# EasyEDA Pro project ProPrj_LXBRC-STM32F405飞控_2024-08-19.epro, schematic LXBRC-F405_V1.1

## Sheets
1 F405_V1.1: Create Date: 2023-12-14; Page Name: F405_V1.1; Project Name: LXBRC-STM32F405飞控; Schematic Name: LXBRC-F405_V1.1; Update Date: 2023-12-14; Company: 嘉立创EDA; Page Size: A0; Version: V1.0
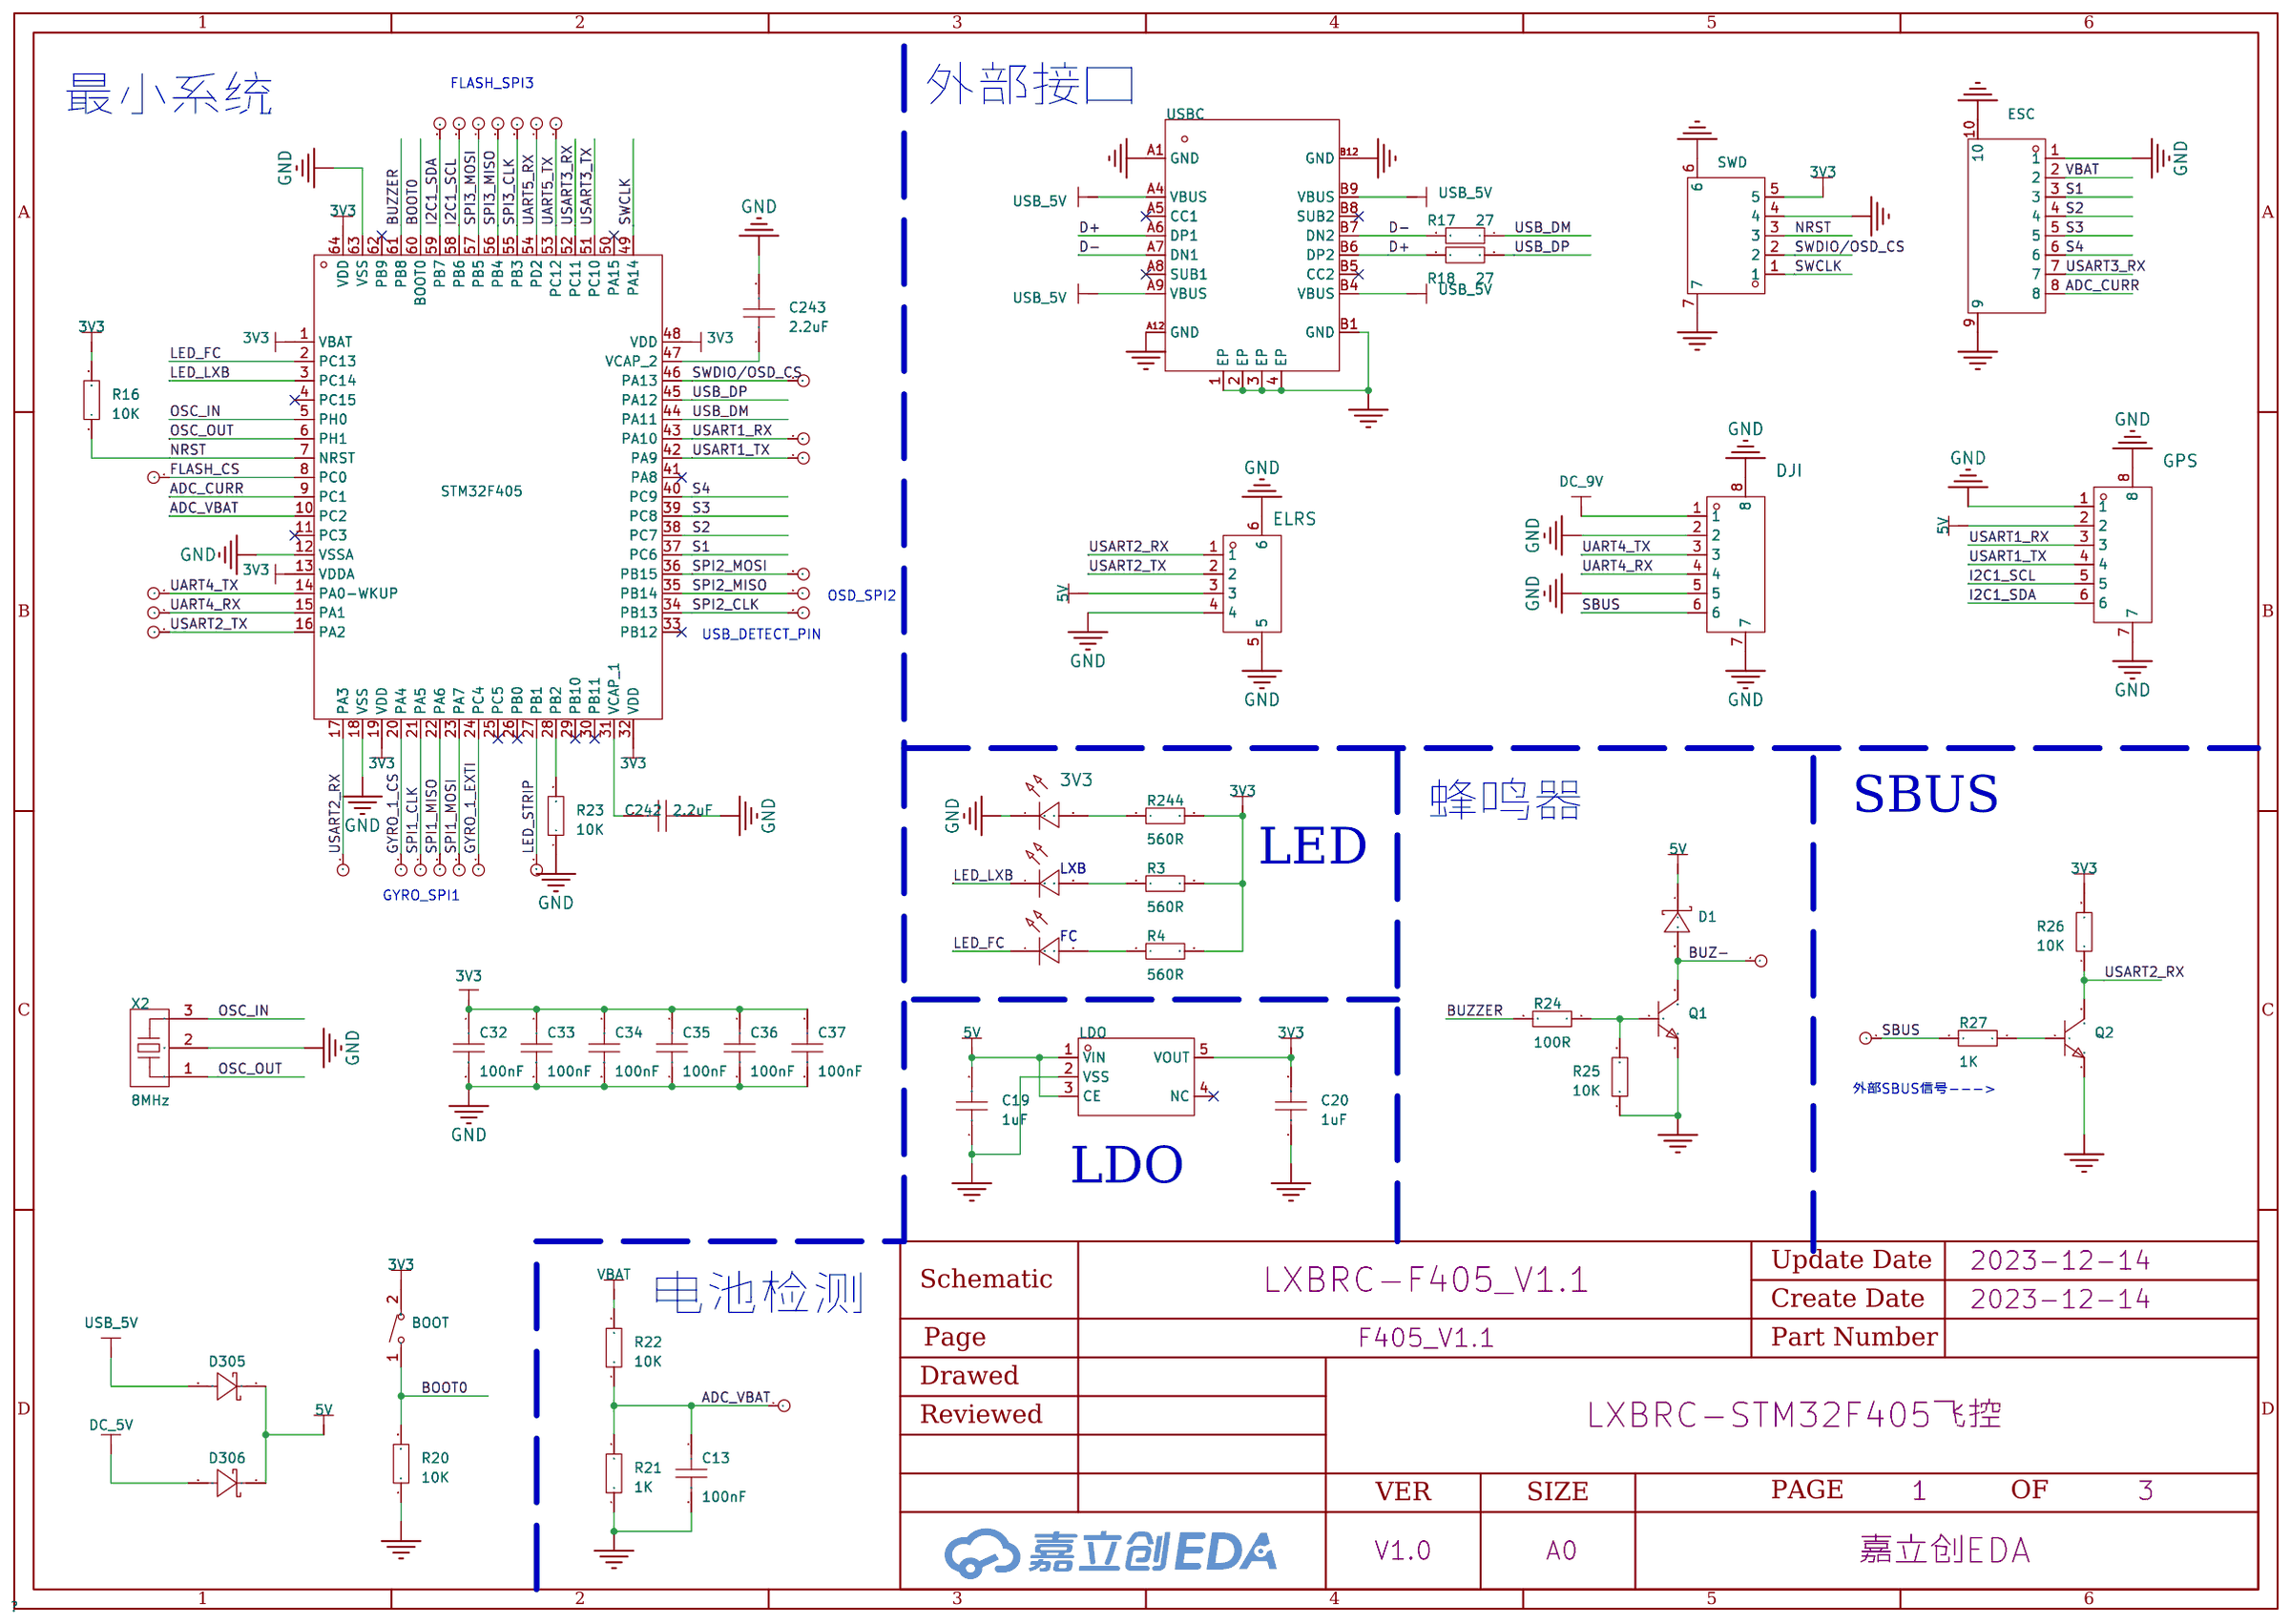
[diagram p0: F405_V1.1]
2 Power_V1.1: Create Date: 2023-06-24; Page Name: Power_V1.1; Project Name: LXBSZ-F405; Schematic Name: LXBSZ-F405_V1.0; Update Date: 2023-11-19; Page Size: A4
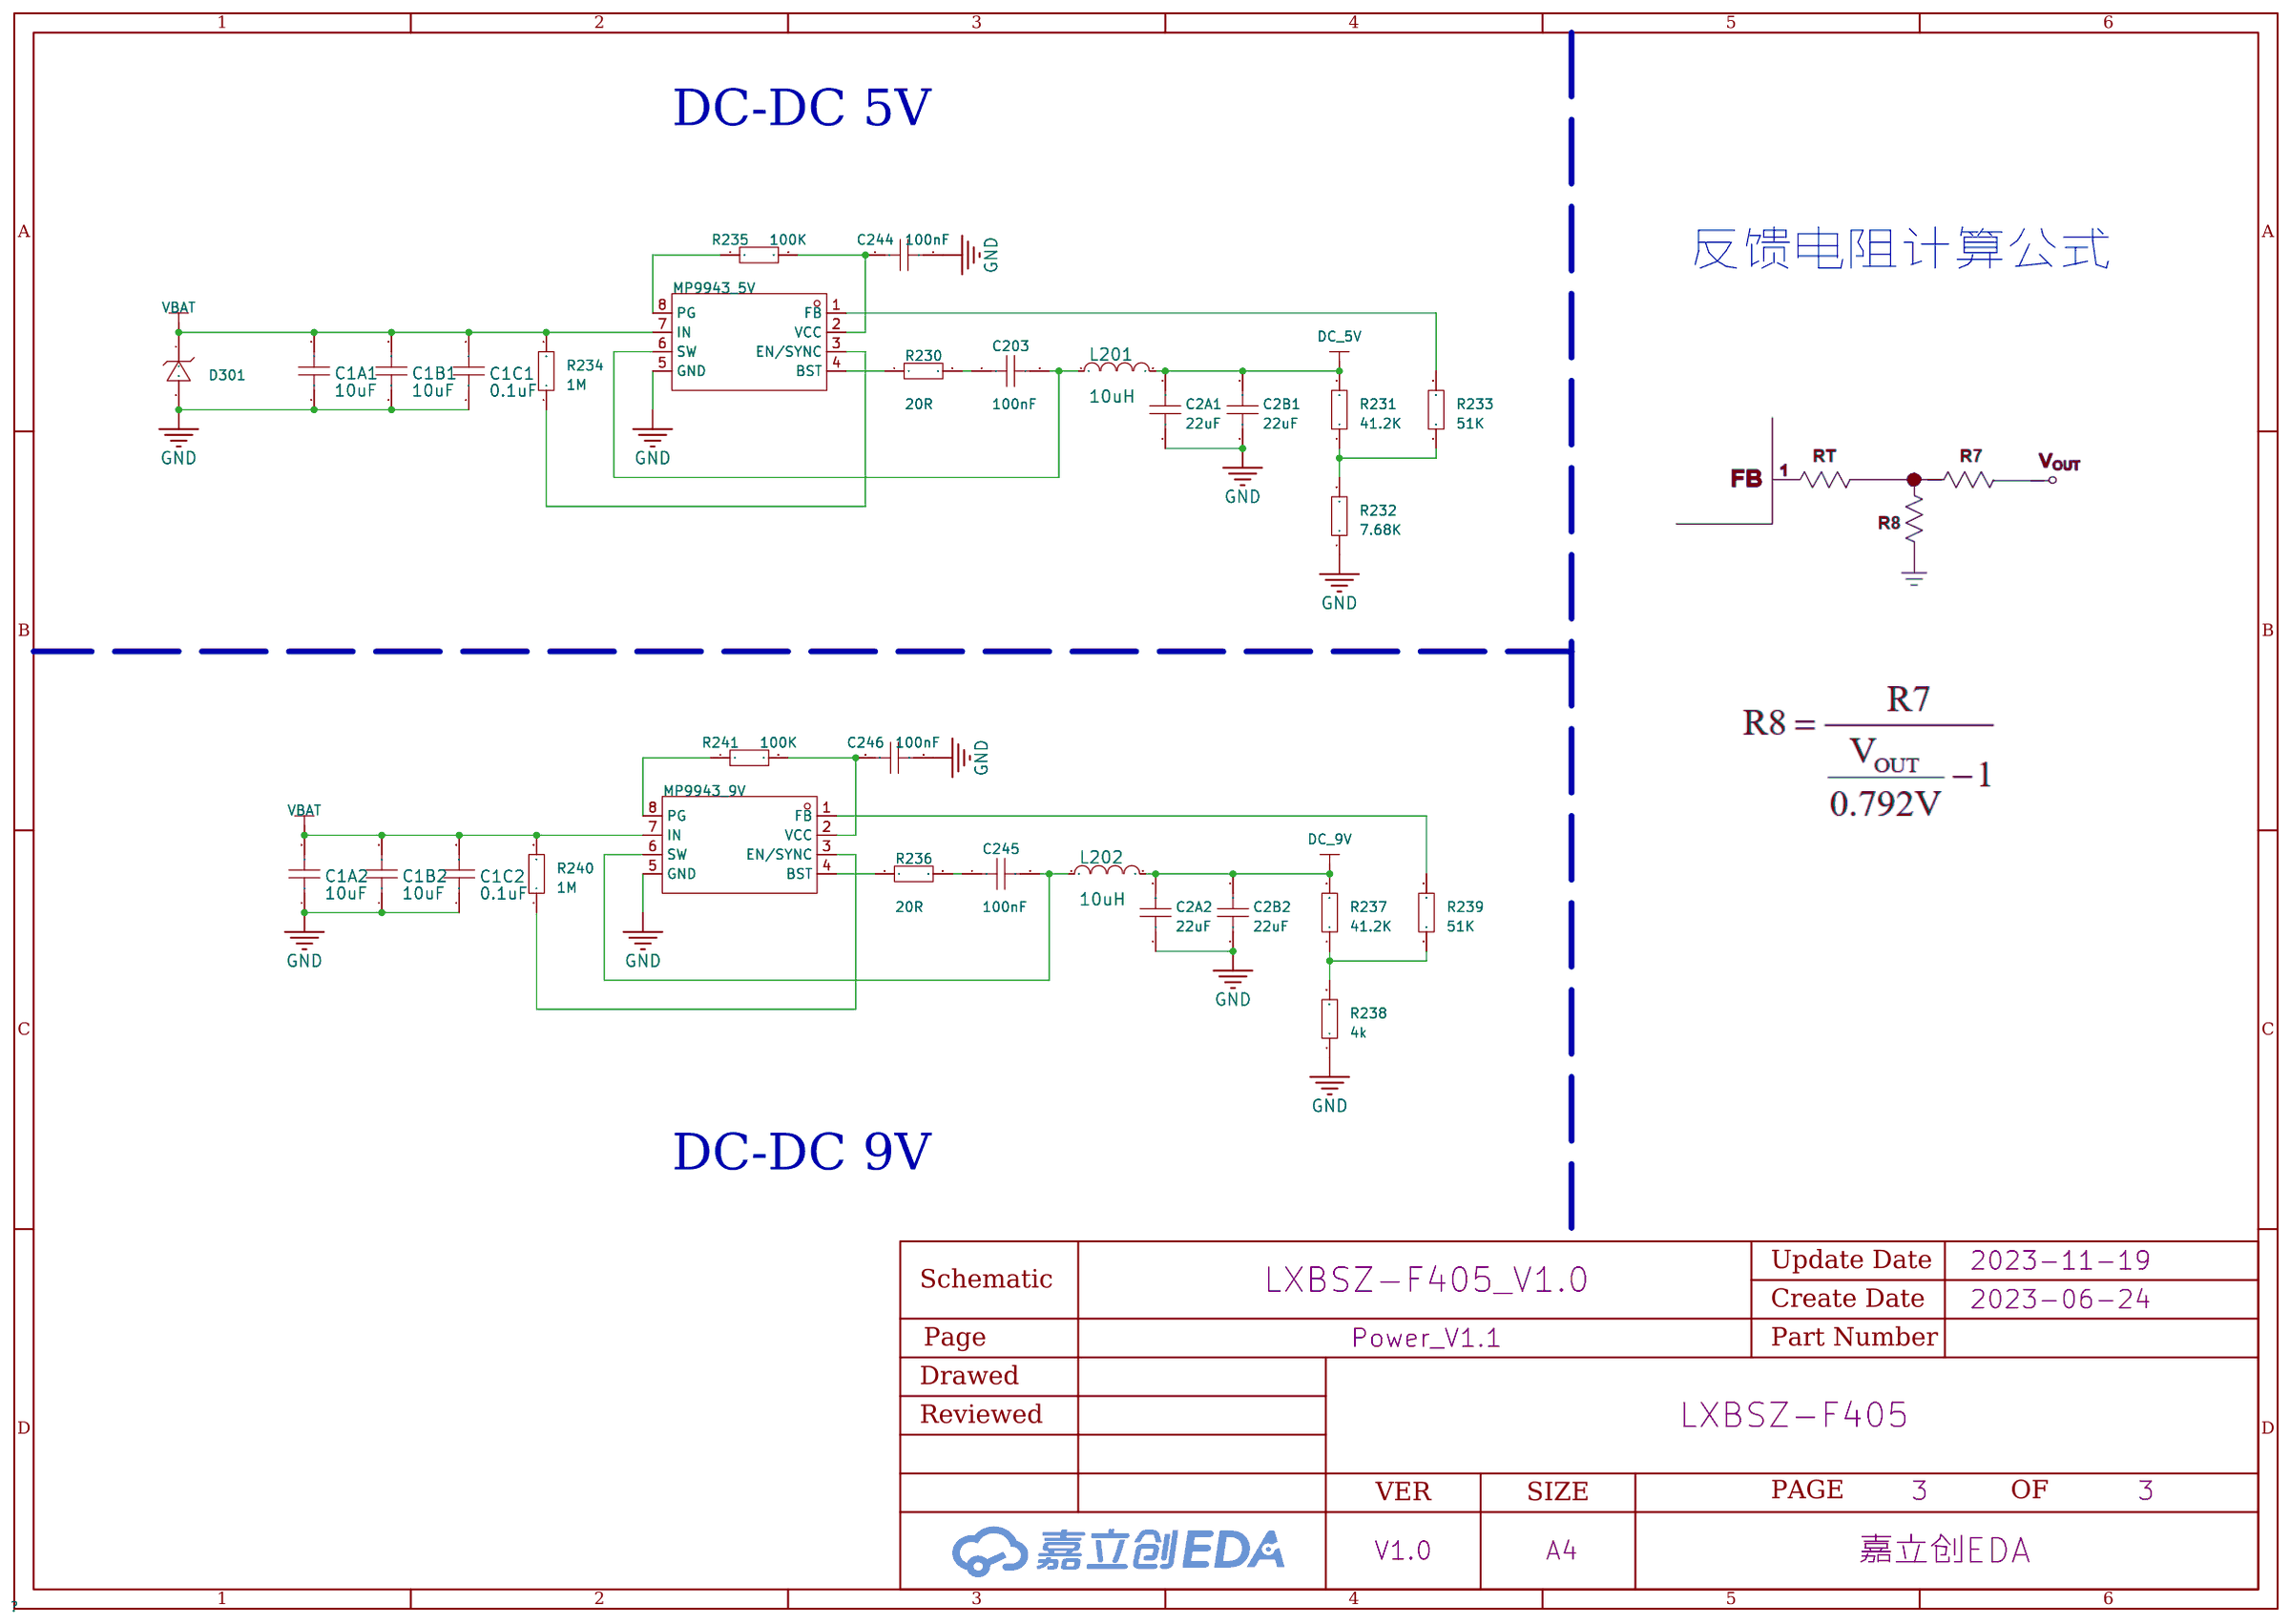
[diagram p1: Power_V1.1]
3 Peripheral_V1.1: Create Date: 2023-06-24; Page Name: Peripheral_V1.1; Project Name: LXBSZ-F405; Schematic Name: LXBSZ-F405_V1.0; Update Date: 2023-11-19; Page Size: A4
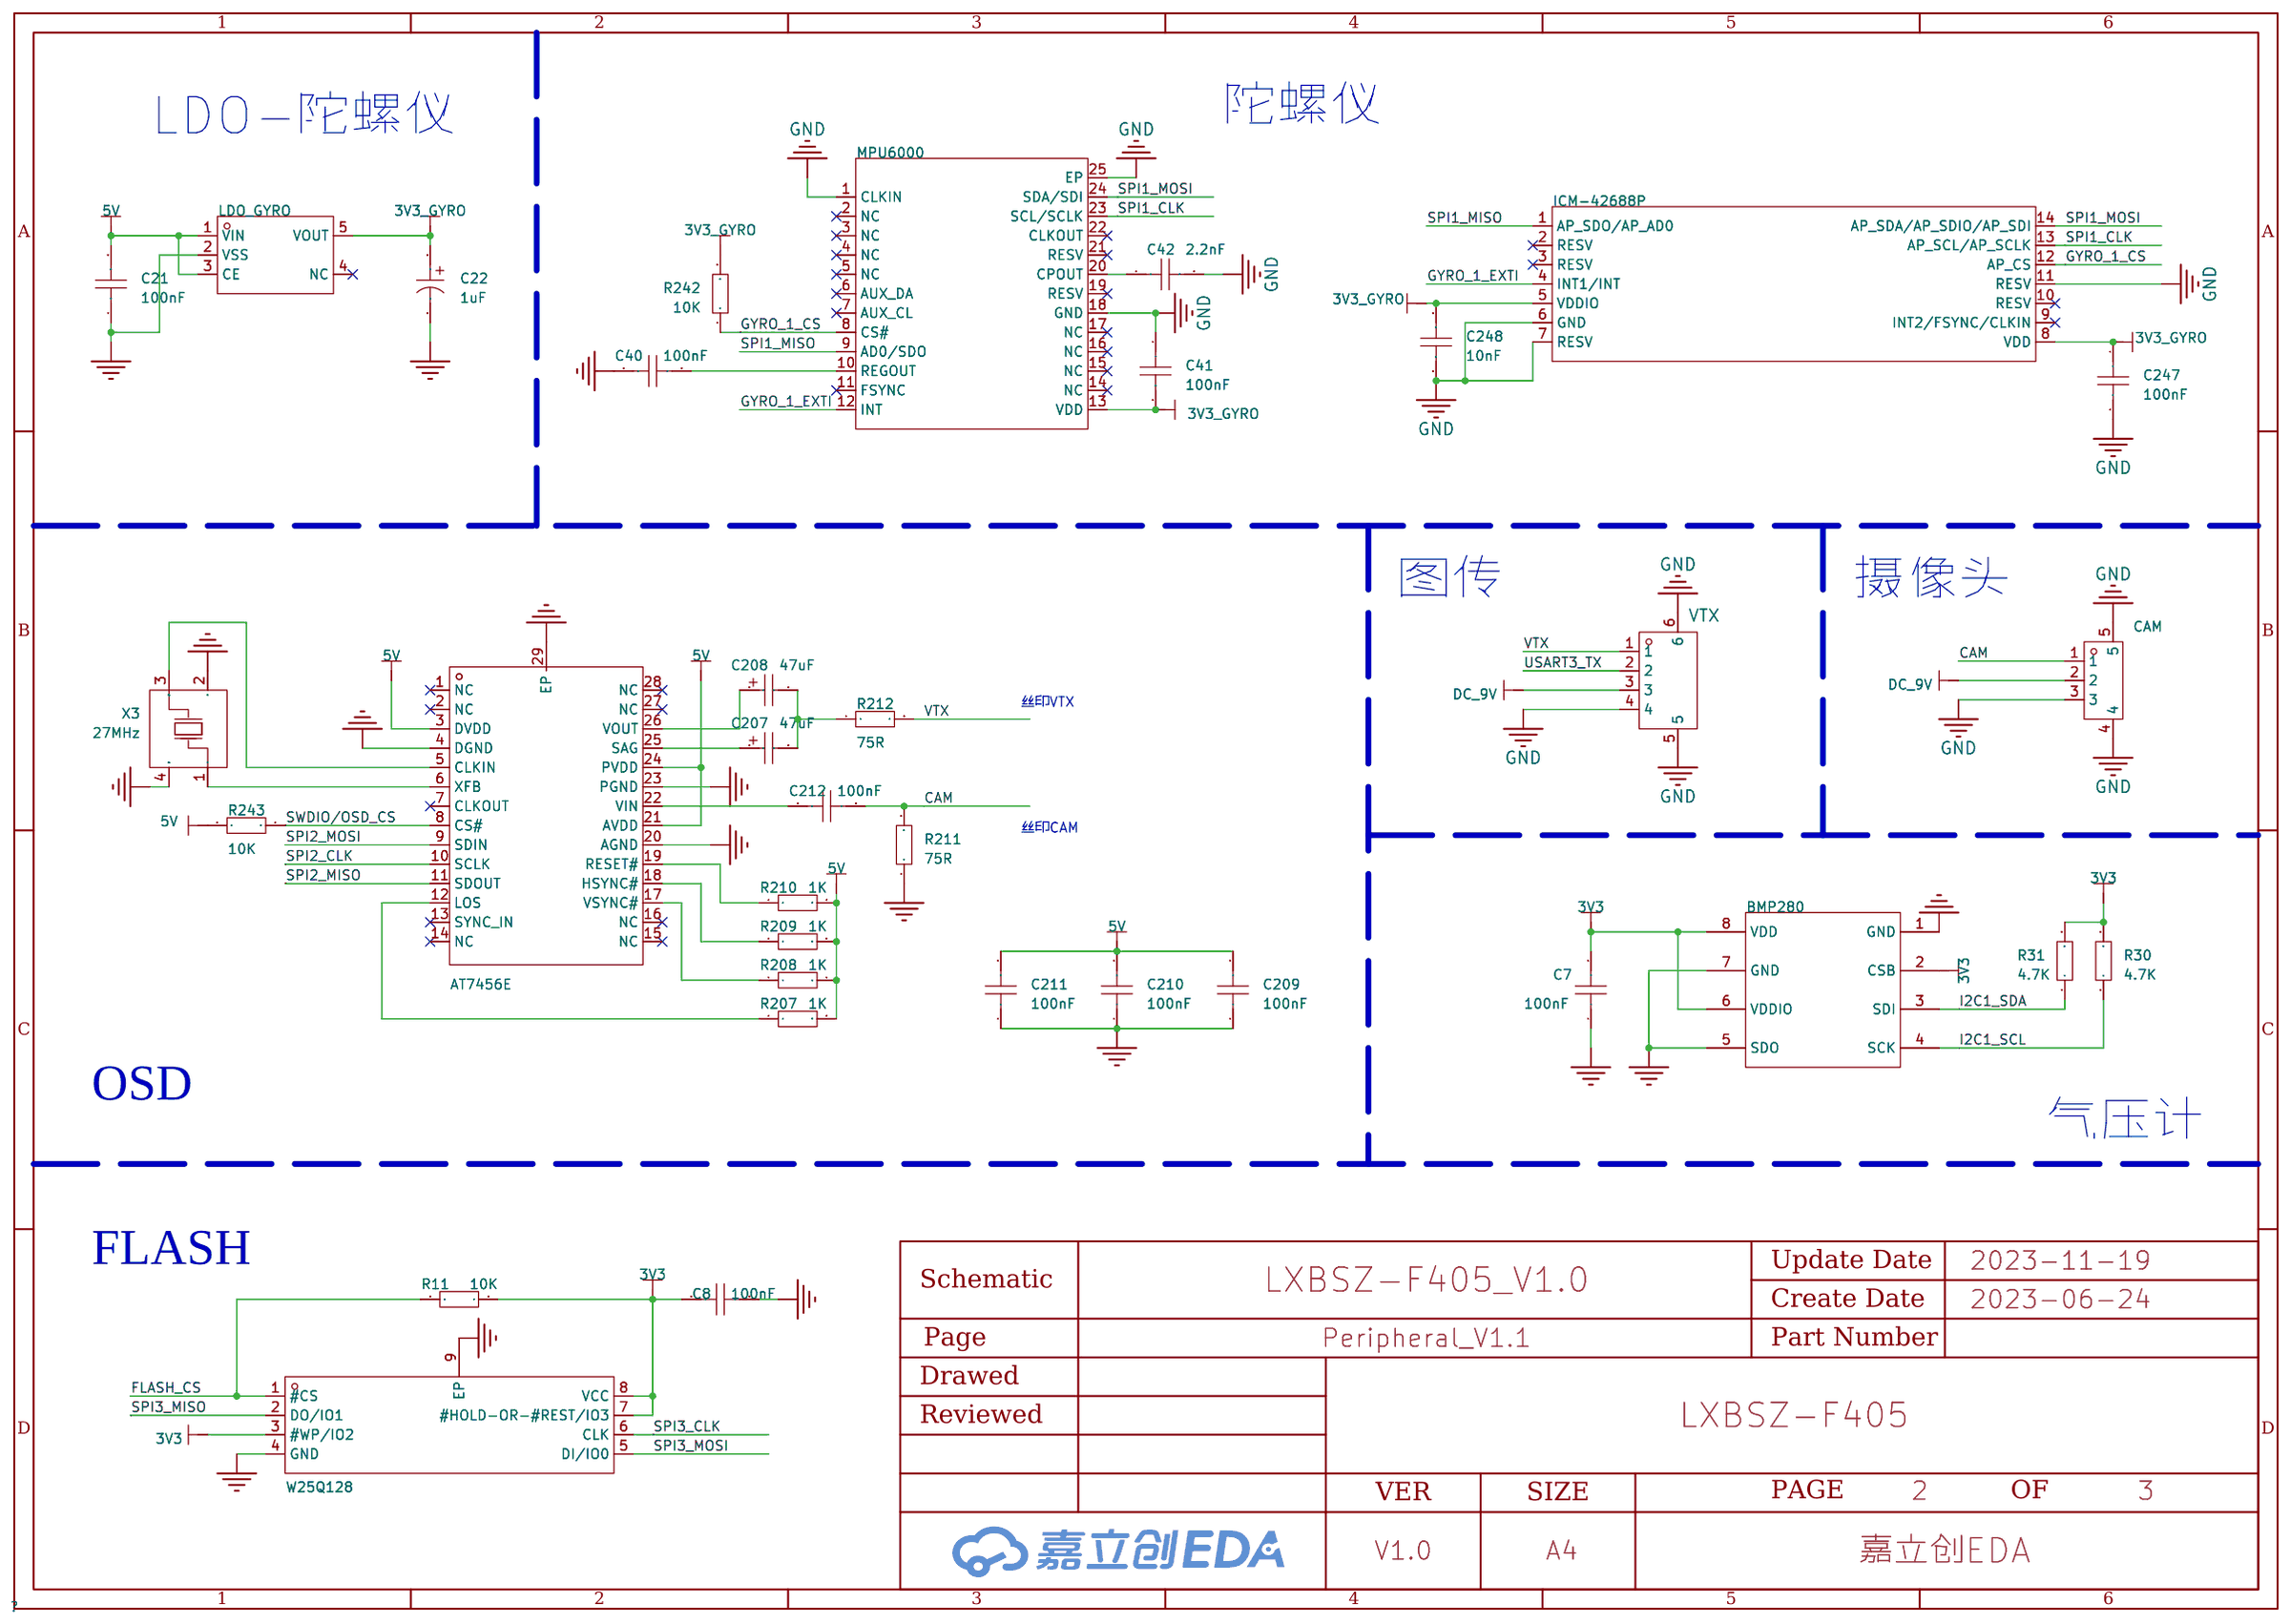
[diagram p2: Peripheral_V1.1]

## Parts
sheet F405_V1.1
3V3  -  [LED_0402]
BOOT  TS2306A 200gf 002  [SW-SMD_L3.0-W2.0-LS3.5]
C13  100nF  [C0402]
C19  1uF  [C0603]
C20  1uF  [C0603]
C32  100nF  [C0402]
C33  100nF  [C0402]
C34  100nF  [C0402]
C35  100nF  [C0402]
C36  100nF  [C0402]
C37  100nF  [C0402]
C242  2.2uF  [C0402]
C243  2.2uF  [C0402]
D1  B5819WS  [SOD-323_L1.8-W1.3-LS2.5-RD]
D305  B5819W  [SOD-123F_L2.7-W1.6-LS3.8-RD-1]
D306  B5819W  [SOD-123F_L2.7-W1.6-LS3.8-RD-1]
DJI  ZX-SH1.0-6PWT  [CONN-SMD_6P-P1.00_MEGASTAR_ZX-SH1.0-6PWT]
ELRS  ZX-SH1.0-4PWT  [CONN-SMD_4P-P1.00_MEGASTAR_ZX-SH1.0-4PWT]
ESC  A1002WR-S-8P  [CONN-SMD_8P-P1.00_MEGASTAR_ZX-SH1.0-8PWT]
FC  -  [LED_0402]
G2  -  [通孔焊盘]
G3  -  [通孔焊盘]
G4  -  [通孔焊盘]
G7  -  [通孔焊盘]
G8  -  [通孔焊盘]
G9  -  [通孔焊盘]
G10  -  [通孔焊盘]
G11  -  [通孔焊盘]
G12  -  [通孔焊盘]
G13  -  [通孔焊盘]
G14  -  [通孔焊盘]
G15  -  [通孔焊盘]
G16  -  [通孔焊盘]
G17  -  [通孔焊盘]
G18  -  [通孔焊盘]
G19  -  [通孔焊盘]
G20  -  [通孔焊盘]
G21  -  [通孔焊盘]
G22  -  [通孔焊盘]
G23  -  [通孔焊盘]
G24  -  [通孔焊盘]
G25  -  [通孔焊盘]
G26  -  [通孔焊盘]
G27  -  [通孔焊盘]
G28  -  [通孔焊盘]
GPS  ZX-SH1.0-6PWT  [CONN-SMD_6P-P1.00_MEGASTAR_ZX-SH1.0-6PWT]
HP15  -  [通孔焊盘]
LDO  CJ6206B33M  [SOT-23-5_L2.9-W1.6-P0.95-LS2.8-BL]
LXB  -  [LED_0402]
Q1  -  [S8050_SOT-23]
Q2  -  [S8050_SOT-23]
R3  560R  [R0402]
R4  560R  [R0402]
R16  10K  [R0402]
R17  27  [R0402]
R18  27  [R0402]
R20  10K  [R0402]
R21  1K  [R0402]
R22  10K  [R0402]
R23  10K  [R0402]
R24  100R  [R0402]
R25  10K  [R0402]
R26  10K  [R0402]
R27  1K  [R0402]
R244  560R  [R0402]
RC1  -  [通孔焊盘]
STM32F405  STM32F405RGT6V  [LQFP-64_L10.0-W10.0-P0.50-LS12.0-BL]
SWD  A1002WR-S-5P  [CONN-SMD_5P-P1.00_MEGASTAR_ZX-SH1.0-5PWT]
USBC  KH-TYPE-C-16P  [USB-C-SMD_KH-TYPE-C-16P]
X2  8MHz  [OSC-SMD_3P-L3.2-W1.3-P1.2-L]
sheet Peripheral_V1.1
AT7456E  AT7456E  [TSSOP-28_L9.7-W4.4-P0.65-LS6.4-BL-EP-2]
BMP280  BMP280  [WLGA-8_L2.5-W2.0-P0.65-TR_DPS422]
C7  100nF  [C0402]
C8  100nF  [C0402]
C21  100nF  [C0603]
C22  1uF  [CAP-SMD_L1.6-W0.8-RD]
C40  100nF  [C0402]
C41  100nF  [C0402]
C42  2.2nF  [C0402]
C207  47uF  [CASE-A_3216]
C208  47uF  [CASE-A_3216]
C209  100nF  [C0402]
C210  100nF  [C0402]
C211  100nF  [C0402]
C212  100nF  [C0402]
C247  100nF  [C0402]
C248  10nF  [C0402]
CAM  WTB01W03BB  [CONN-SMD_3P-P1.00_BZCN_WTB01W03BB]
ICM-42688P  ICM-42688-P  [LGA-14_L3.0-W2.5-P0.50-TL]
LDO_GYRO  CJ6206B33M  [SOT-23-5_L2.9-W1.6-P0.95-LS2.8-BL]
MPU6000  MPU-6000  [QFN-24_L4.0-W4.0-P0.50-BL-EP2.7]
R11  10K  [R0402]
R30  4.7K  [R0402]
R31  4.7K  [R0402]
R207  1K  [R0402]
R208  1K  [R0402]
R209  1K  [R0402]
R210  1K  [R0402]
R211  75R  [R0402]
R212  75R  [R0402]
R242  10K  [R0402]
R243  10K  [R0402]
VTX  ZX-SH1.0-4PWT  [CONN-SMD_4P-P1.00_MEGASTAR_ZX-SH1.0-4PWT]
W25Q128  W25Q128JVPIQ  [WSON-8_L6.0-W5.0-P1.27-BL-EP]
X3  27MHz  [OSC-SMD_4P-L3.2-W2.5-BL]
sheet Power_V1.1
C1A1  10uF  [C0805]
C1A2  10uF  [C0805]
C1B1  10uF  [C0805]
C1B2  10uF  [C0805]
C1C1  0.1uF  [C0603]
C1C2  0.1uF  [C0603]
C2A1  22uF  [C0805]
C2A2  22uF  [C0805]
C2B1  22uF  [C0805]
C2B2  22uF  [C0805]
C203  100nF  [C0402]
C244  100nF  [C0402]
C245  100nF  [C0402]
C246  100nF  [C0402]
D301  SMF33A  [SOD-123FL_L2.7-W1.8-LS3.8-RD]
L201  10uH  [IND-SMD_L4.4-W4.2]
L202  10uH  [IND-SMD_L4.4-W4.2]
MP9943_5V  MP9943GQ-Z  [QFN-8_L3.0-W3.0-P0.65-BL]
MP9943_9V  MP9943GQ-Z  [QFN-8_L3.0-W3.0-P0.65-BL]
R230  20R  [R0402]
R231  41.2K  [R0402]
R232  7.68K  [R0402]
R233  51K  [R0402]
R234  1M  [R0402]
R235  100K  [R0402]
R236  20R  [R0402]
R237  41.2K  [R0402]
R238  4k  [R0402]
R239  51K  [R0402]
R240  1M  [R0402]
R241  100K  [R0402]

## Library data of the parts
3V3 = LED_0402-R: Supplier Footprint: 0402
BOOT = TS2306A 200gf 002: 触点电流：10mA 额定电压(DC)：5V 电路结构：单刀单掷 安装方式：立贴 按钮形状：圆形按钮 开关长度：3mm 开关宽度：2mm 开关高度：0.6mm 2x3x0.6 3x2激光内点轻触开关蓝牙耳机两脚贴片锅仔开关; LCSC Part Name: 薄膜开关 2*3*0.6mm 蓝牙耳机/开机按键 两脚 黄膜黑点 200gf; Supplier Part: C5363482; Manufacturer: SHOU HAN(首韩); Supplier Footprint: SMD; JLCPCB Part Class: 扩展库; Datasheet: https://atta.szlcsc.com/upload/public/pdf/source/20230321/144662D432400ADC228EB2A996730BBD.pdf; Supplier: LCSC
C7 C8 C13 C32-C37 C40-C42 C203 C209-C212 C242-C248 = CAP_0402: Supplier Footprint: 0402
C19-C21 = CAP_0603: Supplier Footprint: 0603
D1 = B5819WS_C488405: 直流反向耐压(Vr):40V;平均整流电流(Io):1A;正向压降(Vf):900mV@3A;; LCSC Part Name: 40V 1A 900mV@3A; Supplier Part: C488405; Manufacturer: Slkor(萨科微); Supplier Footprint: SOD-323; JLCPCB Part Class: Extended Part; Datasheet: https://atta.szlcsc.com/upload/public/pdf/source/20200225/C488405_E29BA61770FF7744B37A87F1ECFA4444.pdf; Supplier: LCSC; Reverse Voltage (Vr): 40V; Average Rectified Current (Io): 1A; Forward Voltage (Vf@If): 900mV@3A
D305 D306 = B5819W: 二极管配置:-;直流反向耐压(Vr):40V;平均整流电流(Io):1A;正向压降(Vf):580mV@1A;; LCSC Part Name: 40V 1A 580mV@1A; Supplier Part: C2943878; Manufacturer: GOODWORK(固得沃克); Supplier Footprint: SOD-123; JLCPCB Part Class: 扩展库; Datasheet: https://atta.szlcsc.com/upload/public/pdf/source/20220114/81042131F39C8520B6390246D7392C1A.pdf; Supplier: LCSC; Reverse Voltage (Vr): 40V; Average Rectified Current (Io): 1A; Forward Voltage (Vf@If): 580mV@1A; Reverse Leakage Current (Ir): 50uA@40V
DJI GPS = ZX-SH1.0-6PWT: 参考系列:SH;间距:1mm;插针结构:1x6P;排数:1;每排PIN数:6;行距:-;公母:公型插针;安装方式:卧贴;额定电流:1A;触头材质:黄铜;触头镀层:锡;工作温度范围:-25℃~+85℃;焊接温度(最大值):260℃;; LCSC Part Name: 系列:SH 1mm 1x6P 卧贴; Supplier Part: C7430448; Manufacturer: Megastar(兆星); Supplier Footprint: SMD,P=1mm; JLCPCB Part Class: 扩展库; Datasheet: https://atta.szlcsc.com/upload/public/pdf/source/20230619/677B156B919545DC550B043554513491.pdf; Supplier: LCSC; Reference Series: SH; Pitch: 1mm; Pins Structure: 1x6P; Number of Rows: 1; Number of PINs Per Row: 6; Gender: 公型插针; Mounting Style: 卧贴; Current Rating (Max): 1A; Contact Material: 黄铜; Contact Plating: 锡; Operating Temperature Range: -25℃~+85℃; Welding Temperature (Max): 260℃
ELRS VTX = ZX-SH1.0-4PWT: 参考系列:SH;间距:1mm;插针结构:1x4P;排数:1;每排PIN数:4;行距:-;公母:公型插针;安装方式:卧贴;额定电流:1A;触头材质:黄铜;触头镀层:锡;工作温度范围:-25℃~+85℃;焊接温度(最大值):260℃;; LCSC Part Name: SH 1mm 1x4P 卧贴; Supplier Part: C7430446; Manufacturer: Megastar(兆星); Supplier Footprint: SMD,P=1mm; JLCPCB Part Class: 扩展库; Datasheet: https://atta.szlcsc.com/upload/public/pdf/source/20230619/390816C24B7A0EB1D042395C380CEA99.pdf; Supplier: LCSC; Reference Series: SH; Pitch: 1mm; Pins Structure: 1x4P; Number of Rows: 1; Number of PINs Per Row: 4; Gender: 公型插针; Mounting Style: 卧贴; Current Rating (Max): 1A; Contact Material: 黄铜; Contact Plating: 锡; Operating Temperature Range: -25℃~+85℃; Welding Temperature (Max): 260℃
ESC = A1002WR-S-8P: 系列:SH;连接器类型:接头;触头类型:公形引脚;间距:0.039quot;(1.00mm);针脚数:8;; LCSC Part Name: 8P,脚距1mm; Supplier Part: C239526; Manufacturer: CJT(长江连接器); Supplier Footprint: SMD,P=1mm; JLCPCB Part Class: Extended Part; Datasheet: https://atta.szlcsc.com/upload/public/pdf/watermark/20190926/C239526_E6EB898D74B3D7AFB647860A542281E4.pdf; Supplier: LCSC; Series: SH; Connector Type: 接头; Contact Type: 公形引脚; Pitch: 0.039quot;(1.00mm); Number of Positions: 8; Number of Rows: 1; Mounting Type: 表面贴装; Contact Material: 磷青铜
FC = LED_0402-B: Supplier Footprint: 0402
G2-G4 G7-G28 HP15 RC1 = 焊盘
LDO LDO_GYRO = CJ6206B33M: Supplier Part: C2829379; Manufacturer: CJ(江苏长电/长晶); Supplier Footprint: SOT-23-5; JLCPCB Part Class: Extended Part; Datasheet: https://atta.szlcsc.com/upload/public/pdf/source/20211115/34F24E85C3E0007400D8689F65084E71.pdf; Supplier: LCSC
LXB = LED_0402-G: Supplier Footprint: 0402
Q1 Q2 = S8050_SOT_NPN: Supplier Footprint: SOT-23
R3 R4 R11 R16-R18 R20-R27 R30 R31 R207-R212 R230-R244 = Res_0402: Supplier Footprint: 0402
STM32F405 = STM32F405RGT6V: Supplier Part: C1338696; Manufacturer: ST(意法半导体); Supplier Footprint: LQFP-64(10x10); JLCPCB Part Class: Extended Part; Datasheet: https://atta.szlcsc.com/upload/public/pdf/source/20201130/C919362_39400D478C258148B3DF984CE4A4041A.pdf; Supplier: LCSC
SWD = A1002WR-S-5P: 系列:SH;连接器类型:接头;触头类型:公形引脚;间距:0.039quot;(1.00mm);针脚数:5;; LCSC Part Name: 5P,脚距1mm; Supplier Part: C239523; Manufacturer: CJT(长江连接器); Supplier Footprint: SMD,P=1mm; JLCPCB Part Class: Extended Part; Datasheet: https://atta.szlcsc.com/upload/public/pdf/watermark/20190926/C239523_C46D0F4862EEDD4972FF1B73A94711EF.pdf; Supplier: LCSC; Series: SH; Connector Type: 接头; Contact Type: 公形引脚; Pitch: 0.039quot;(1.00mm); Number of Positions: 5; Number of Rows: 1; Mounting Type: 表面贴装; Contact Material: 磷青铜
USBC = KH-TYPE-C-16P: 连接器类型:Type-C;标准:-;公母:母座;触点数量:16;端口数量:1;安装方式:卧贴;额定电流 - 电源:3A;工作温度范围:-40℃~+85℃;; LCSC Part Name: Type-C 母座 卧贴; Supplier Part: C709357; Manufacturer: kinghelm(金航标); Supplier Footprint: SMD; JLCPCB Part Class: Extended Part; Datasheet: https://atta.szlcsc.com/upload/public/pdf/source/20200911/C709357_AA8DCEB38BB20E3035A7ED7AE7667837.pdf; Supplier: LCSC; Connector Type: Type-C; Gender: 母座; Number of Contacts: 16; Number of Ports: 1; Mounting Style: 卧贴; Current Rating - Power (Max): 3A; Operating Temperature Range: -40℃~+85℃
X2 = CSTCE8M00G15C99-R0: 频率:8MHz;频率容差:±0.1%;内置负载电容:33pF;谐振阻抗:40Ω;; LCSC Part Name: 8MHz ±0.1% 内置负载电容:33pF; Supplier Part: C110614; Manufacturer: muRata(村田); Supplier Footprint: SMD3213-3P; JLCPCB Part Class: Extended Part; Datasheet: https://atta.szlcsc.com/upload/public/pdf/source/20180327/C110614_9F5031E08ADB10DE4472527BF78A8CAF.pdf; Supplier: LCSC; Frequency Tolerance: ±0.1%; Built-in Load Capacitance: 33pF; Resonant Impedance: 40Ω; Operating Temperature: -40℃~+125℃
AT7456E = AT7456E: 视频字符叠加芯片，跟MAX7456-pin-pin; Supplier Part: C82351; Manufacturer: 杭州中科微; Supplier Footprint: TSSOP-28; JLCPCB Part Class: Extended Part; Datasheet: https://atta.szlcsc.com/upload/public/pdf/source/20180326/C82351_A40539A53E8345C88178541014FDE5FB.pdf; Supplier: LCSC
BMP280 = BMP280: Bosch气压传感器新品，可测量大气压力，带高精度温度测量，可校准精确计算海拔高度。I2C或SPI接口，宽量程（300-1100hpa），精度高; Supplier Part: C83291; Manufacturer: Bosch(博世); Supplier Footprint: LGA-8(2x2.5); JLCPCB Part Class: Extended Part; Datasheet: https://atta.szlcsc.com/upload/public/pdf/source/20200702/C83291_F39E84AB7DFC569A4C7554F8659640A1.pdf; Supplier: LCSC
C22 = F980J476MMA: 容值:47uF;精度:±20%;额定电压:6.3V;漏电流:-;纹波电流:20mA@100kHz;等效串联电阻:10Ω@100kHz;工作温度:-55℃~+125℃;; LCSC Part Name: 47uF ±20% 6.3V; Supplier Part: C1952739; Manufacturer: Kyocera AVX; Supplier Footprint: 0603; JLCPCB Part Class: 扩展库; Datasheet: https://atta.szlcsc.com/upload/public/pdf/source/20211207/218718C9D5A7FAAA07FA57F61A08BACF.pdf; Supplier: LCSC; Tolerance: ±20%; Rated Voltage: 6.3V; Ripple Current: 20mA@100kHz; Equivalent Series Resistance(ESR): 10Ω@100kHz; Operating Temperature: -55℃~+125℃
C207 C208 = TAJA476K006RNJ: 容值:47uF;精度:±10%;额定电压:6.3V;等效串联电阻:1.6Ω@100kHz;; LCSC Part Name: 47uF ±10% 6.3V; Supplier Part: C7190; Manufacturer: Kyocera AVX; Supplier Footprint: CASE-A-3216; JLCPCB Part Class: 扩展库; Datasheet: https://atta.szlcsc.com/upload/public/pdf/source/20160107/1457707748639.pdf; Supplier: LCSC; Tolerance: ±10%; Rated Voltage: 6.3V; Equivalent Series Resistance(ESR): 1.6Ω@100kHz; Operating Temperature: -55℃~+125℃
CAM = WTB01W03BB: LCSC Part Name: SH1.0-3AWB卧贴I冷封编带; Supplier Part: C3036372; Manufacturer: BZCN(博众电气); Supplier Footprint: SMD,P=1mm; JLCPCB Part Class: 扩展库; Datasheet: https://atta.szlcsc.com/upload/public/pdf/source/20220719/924E2D9E86C44D9913D2574AA28B9129.pdf; Supplier: LCSC
ICM-42688P = ICM-42688-P: LCSC Part Name: ICM 42688 P; Supplier Part: C1850418; Manufacturer: TDK InvenSense(应美盛); Supplier Footprint: LGA-14(2.5x3); JLCPCB Part Class: 扩展库; Datasheet: https://atta.szlcsc.com/upload/public/pdf/source/20210703/CF24204867ACE5B754A2B035F23E5931.pdf; Supplier: LCSC
MPU6000 = MPU-6000: 三轴加速度计和三轴陀螺仪; Supplier Part: C92401; Manufacturer: TDK InvenSense(应美盛); Supplier Footprint: QFN-24_4x4x05P; JLCPCB Part Class: Extended Part; Datasheet: https://atta.szlcsc.com/upload/public/pdf/source/20170418/1492506341548.pdf; Supplier: LCSC
W25Q128 = W25Q128JVPIQ_C190862: Supplier Part: C190862; Manufacturer: WINBOND(华邦); Supplier Footprint: WSON-8(6x5); JLCPCB Part Class: Extended Part; Datasheet: https://atta.szlcsc.com/upload/public/pdf/source/20180503/C190862_7F915C2268E9B07C8B0888F9767EF5A6.pdf; Supplier: LCSC
X3 = X322527MSB4SI: 频率:27MHz;频率公差:±10ppm;负载电容:20pF;; LCSC Part Name: 27MHz ±10ppm 20pF; Supplier Part: C9008; Manufacturer: YXC(扬兴晶振); Supplier Footprint: SMD3225-4P; JLCPCB Part Class: Extended Part; Datasheet: https://atta.szlcsc.com/upload/public/pdf/source/20210924/6E7747CDA2F2290AC736DA7D858AE7E6.pdf; Supplier: LCSC; Crystal Type: 贴片无源晶振; Frequency Tolerance: ±10ppm; Frequency Stability: ±30ppm; Load Capacitance: 20pF; Operating Temperature: -40℃~+85℃
C1A1 C1A2 C1B1 C1B2 = 47uF
C1C1 C1C2 = 0.1uF
C2A1 C2A2 C2B1 C2B2 = CAP_0805: Supplier Footprint: 0805
D301 = SMF33A_C726914: 极性:单向;; LCSC Part Name: 单向; Supplier Part: C726914; Manufacturer: TWGMC(台湾迪嘉); Supplier Footprint: SOD-123FL; JLCPCB Part Class: 扩展库; Datasheet: https://atta.szlcsc.com/upload/public/pdf/source/20200825/C726891_B615A55314C94A3B16B7FBCD32D40567.pdf; Supplier: LCSC; Polarity: 单向
L201 L202 = FXL0420-100-M: 类型:一体成型电感;电感值:10uH;精度:±20%;额定电流:1.6A;饱和电流(Isat):2.2A;; LCSC Part Name: 10uH ±20% 2.2A; Supplier Part: C177242; Manufacturer: cjiang(长江微电); Supplier Footprint: SMD,4.2x4.4mm; JLCPCB Part Class: 扩展库; Datasheet: https://atta.szlcsc.com/upload/public/pdf/source/20200117/C485363_A2440626DC7482D75DD0DD56D1883FBF.pdf; Supplier: LCSC; Type: 一体成型电感; Tolerance: ±20%; Rated Current: 1.6A; Saturation Current (Isat): 2.2A; DC Resistance (DCR): 282mΩ
MP9943_5V MP9943_9V = MP9943GQ-Z: Supplier Part: C477821; Supplier Footprint: QFN-8_3x3mm; JLCPCB Part Class: 扩展库; Datasheet: 2021-05-22/374398S/94eb60b6438e46f987ac1f72df989e4b/MP9943.pdf; Supplier: LCSC

## Nets
3V3: BMP280.2(CSB) BMP280.6(VDDIO) BMP280.8(VDD) BOOT.2(A&apos;) C7.2 C8.2 C20.2 C32.1 C33.1 C34.1 C35.1 C36.1 C37.1 LDO.5(VOUT) R3.2 R4.2 R11.2 R16.2 R26.2 R30.2 R31.2 R244.2 STM32F405.1(VBAT) STM32F405.13(VDDA) STM32F405.19(VDD) STM32F405.32(VDD) STM32F405.48(VDD) STM32F405.64(VDD) SWD.5 W25Q128.3(#WP/IO2) W25Q128.7(#HOLD-OR-#REST/IO3) W25Q128.8(VCC)
3V3_GYRO: C22.1 C41.2 C247.1 C248.1 ICM-42688P.5(VDDIO) ICM-42688P.8(VDD) LDO_GYRO.5(VOUT) MPU6000.13(VDD) R242.2
5V: AT7456E.3(DVDD) AT7456E.21(AVDD) AT7456E.24(PVDD) C19.2 C21.2 C209.2 C210.2 C211.2 D1.1(K) D305.1(K) D306.1(K) ELRS.3 GPS.2 LDO.1(VIN) LDO.3(CE) LDO_GYRO.1(VIN) LDO_GYRO.3(CE) R207.2 R208.2 R209.2 R210.2 R243.2
GND: 3V3.1(C) AT7456E.4(DGND) AT7456E.20(AGND) AT7456E.23(PGND) AT7456E.29(EP) BMP280.1(GND) BMP280.5(SDO) BMP280.7(GND) C1A1.1 C1A2.1 C1B1.1 C1B2.1 C1C1.1 C1C2.1 C2A1.1 C2A2.1 C2B1.1 C2B2.1 C7.1 C8.1 C13.2 C19.1 C20.1 C21.1 C22.2 C32.2 C33.2 C34.2 C35.2 C36.2 C37.2 C40.2 C41.1 C42.2 C209.1 C210.1 C211.1 C242.2 C243.2 C244.1 C246.1 C247.2 C248.2 CAM.3 CAM.4 CAM.5 D301.2 DJI.2 DJI.5 DJI.7 DJI.8 ELRS.4 ELRS.5 ELRS.6 ESC.1 ESC.9 ESC.10 GPS.1 GPS.7 GPS.8 ICM-42688P.6(GND) ICM-42688P.7(RESV) ICM-42688P.11(RESV) LDO.2(VSS) LDO_GYRO.2(VSS) MP9943_5V.5(GND) MP9943_9V.5(GND) MPU6000.1(CLKIN) MPU6000.18(GND) MPU6000.25(EP) Q1.2 Q2.2 R20.1 R21.1 R23.1 R25.1 R211.1 R232.1 R238.1 STM32F405.12(VSSA) STM32F405.18(VSS) STM32F405.63(VSS) SWD.4 SWD.6 SWD.7 USBC.1(EP) USBC.2(EP) USBC.3(EP) USBC.4(EP) USBC.A1(GND) USBC.A12(GND) USBC.B1(GND) USBC.B12(GND) VTX.4 VTX.5 VTX.6 W25Q128.4(GND) W25Q128.9(EP) X2.2 X3.2(GND) X3.4(GND)
VBAT: C1A1.2 C1A2.2 C1B1.2 C1B2.2 C1C1.2 C1C2.2 D301.1 ESC.2 MP9943_5V.7(IN) MP9943_9V.7(IN) R22.2 R234.2 R240.2
ADC_CURR: ESC.8 STM32F405.9(PC1)
ADC_VBAT: C13.1 HP15.1 R21.2 R22.1 STM32F405.10(PC2)
BOOT0: BOOT.1(A) R20.2 STM32F405.60(BOOT0)
BUZ-: D1.2(A) G28.1 Q1.3
BUZZER: R24.2 STM32F405.61(PB8)
CAM: C212.2 CAM.1 R211.2
D+: R18.2 USBC.A6(DP1) USBC.B6(DP2)
D-: R17.2 USBC.A7(DN1) USBC.B7(DN2)
DC_5V: C2A1.2 C2B1.2 D306.2(A) L201.2 R231.2
DC_9V: C2A2.2 C2B2.2 CAM.2 DJI.1 L202.2 R237.2 VTX.3
FLASH_CS: G12.1 R11.1 STM32F405.8(PC0) W25Q128.1(#CS)
GYRO_1_CS: G16.1 ICM-42688P.12(AP_CS) MPU6000.8(CS#) R242.1 STM32F405.20(PA4)
GYRO_1_EXTI: G20.1 ICM-42688P.4(INT1/INT) MPU6000.12(INT) STM32F405.24(PC4)
I2C1_SCL: BMP280.4(SCK) G15.1 GPS.5 R30.1 STM32F405.58(PB6)
I2C1_SDA: BMP280.3(SDI) G14.1 GPS.6 R31.1 STM32F405.59(PB7)
LED_FC: FC.1(C) STM32F405.2(PC13)
LED_LXB: LXB.1(C) STM32F405.3(PC14)
LED_STRIP: G27.1 STM32F405.27(PB1)
NRST: R16.1 STM32F405.7(NRST) SWD.3
OSC_IN: STM32F405.5(PH0) X2.3
OSC_OUT: STM32F405.6(PH1) X2.1
S1: ESC.3 STM32F405.37(PC6)
S2: ESC.4 STM32F405.38(PC7)
S3: ESC.5 STM32F405.39(PC8)
S4: ESC.6 STM32F405.40(PC9)
SBUS: DJI.6 R27.2 RC1.1
SPI1_CLK: G17.1 ICM-42688P.13(AP_SCL/AP_SCLK) MPU6000.23(SCL/SCLK) STM32F405.21(PA5)
SPI1_MISO: G18.1 ICM-42688P.1(AP_SDO/AP_AD0) MPU6000.9(AD0/SDO) STM32F405.22(PA6)
SPI1_MOSI: G19.1 ICM-42688P.14(AP_SDA/AP_SDIO/AP_SDI) MPU6000.24(SDA/SDI) STM32F405.23(PA7)
SPI2_CLK: AT7456E.10(SCLK) G23.1 STM32F405.34(PB13)
SPI2_MISO: AT7456E.11(SDOUT) G22.1 STM32F405.35(PB14)
SPI2_MOSI: AT7456E.9(SDIN) G21.1 STM32F405.36(PB15)
SPI3_CLK: G11.1 STM32F405.55(PB3) W25Q128.6(CLK)
SPI3_MISO: G10.1 STM32F405.56(PB4) W25Q128.2(DO/IO1)
SPI3_MOSI: G9.1 STM32F405.57(PB5) W25Q128.5(DI/IO0)
SWCLK: STM32F405.49(PA14) SWD.1
SWDIO/OSD_CS: AT7456E.8(CS#) G24.1 R243.1 STM32F405.46(PA13) SWD.2
UART4_RX: DJI.4 G3.1 STM32F405.15(PA1)
UART4_TX: DJI.3 G2.1 STM32F405.14(PA0-WKUP)
UART5_RX: G25.1 STM32F405.54(PD2)
UART5_TX: G26.1 STM32F405.53(PC12)
USART1_RX: G8.1 GPS.3 STM32F405.43(PA10)
USART1_TX: G7.1 GPS.4 STM32F405.42(PA9)
USART2_RX: ELRS.1 G13.1 Q2.3 R26.1 STM32F405.17(PA3)
USART2_TX: ELRS.2 G4.1 STM32F405.16(PA2)
USART3_RX: ESC.7 STM32F405.52(PC11)
USART3_TX: STM32F405.51(PC10) VTX.2
USB_5V: D305.2(A) USBC.A4(VBUS) USBC.A9(VBUS) USBC.B4(VBUS) USBC.B9(VBUS)
USB_DM: R17.1 STM32F405.44(PA11)
USB_DP: R18.1 STM32F405.45(PA12)
VTX: R212.2 VTX.1
$1N30037: Q1.1 R24.1 R25.2
$1N30154: FC.2(A) R4.1
$1N30155: LXB.2(A) R3.1
$1N30264: Q2.1 R27.1
$1N77134: C242.1 STM32F405.31(VCAP_1)
$1N77171: C243.1 STM32F405.47(VCAP_2)
$1N77291: R23.2 STM32F405.28(PB2)
$1N114320: 3V3.2(A) R244.1
$2N12790: C203.2 L201.1 MP9943_5V.6(SW)
$2N12803: C203.1 R230.2
$2N12807: MP9943_5V.1(FB) R233.2
$2N12810: R231.1 R232.2 R233.1
$2N12815: MP9943_5V.4(BST) R230.1
$2N12817: MP9943_5V.3(EN/SYNC) R234.1
$2N12824: MP9943_5V.8(PG) R235.1
$2N12827: C244.2 MP9943_5V.2(VCC) R235.2
$2N13284: C245.2 L202.1 MP9943_9V.6(SW)
$2N13297: C245.1 R236.2
$2N13301: MP9943_9V.1(FB) R239.2
$2N13304: R237.1 R238.2 R239.1
$2N13309: MP9943_9V.4(BST) R236.1
$2N13311: MP9943_9V.3(EN/SYNC) R240.1
$2N13318: MP9943_9V.8(PG) R241.1
$2N13321: C246.2 MP9943_9V.2(VCC) R241.2
$3N286: C40.1 MPU6000.10(REGOUT)
$3N290: C42.1 MPU6000.20(CPOUT)
$3N1236: AT7456E.6(XFB) X3.1(OSC1)
$3N1237: AT7456E.5(CLKIN) X3.3(OSC2)
$3N1238: AT7456E.12(LOS) R207.1
$3N1240: AT7456E.17(VSYNC#) R208.1
$3N1241: AT7456E.18(HSYNC#) R209.1
$3N1242: AT7456E.19(RESET#) R210.1
$3N1247: AT7456E.22(VIN) C212.1
$3N1251: C207.2 C208.2 R212.1
$3N1252: AT7456E.25(SAG) C207.1
$3N1253: AT7456E.26(VOUT) C208.1

Not connected (* = marked no-connect by the designer): AT7456E 1(NC)* 2(NC)* 7(CLKOUT)* 13(SYNC_IN)* 14(NC)* 15(NC)* 16(NC)* 27(NC)* 28(NC)*; ICM-42688P 2(RESV)* 3(RESV)* 9(INT2/FSYNC/CLKIN)* 10(RESV)*; LDO 4(NC)*; LDO_GYRO 4(NC)*; MPU6000 2(NC)* 3(NC)* 4(NC)* 5(NC)* 6(AUX_DA)* 7(AUX_CL)* 11(FSYNC)* 14(NC)* 15(NC)* 16(NC)* 17(NC)* 19(RESV)* 21(RESV)* 22(CLKOUT)*; STM32F405 4(PC15)* 11(PC3)* 25(PC5)* 26(PB0)* 29(PB10)* 30(PB11)* 33(PB12)* 41(PA8)* 50(PA15)* 62(PB9)*; USBC A5(CC1)* A8(SUB1)* B5(CC2)* B8(SUB2)*

## Notes on the sheets
sheet 1
- FLASH_SPI3
- 外部接口
- 最小系统
- OSD_SPI2
- USB_DETECT_PIN
- LED
- 蜂鸣器
- SBUS
- GYRO_SPI1
- 外部SBUS信号--->
- LDO
- 电池检测
sheet 2
- DC-DC 5V
- 反馈电阻计算公式
- DC-DC 9V
sheet 3
- 陀螺仪
- LDO-陀螺仪
- 图传
- 摄像头
- 丝印VTX
- 丝印CAM
- OSD
- 气压计
- FLASH
